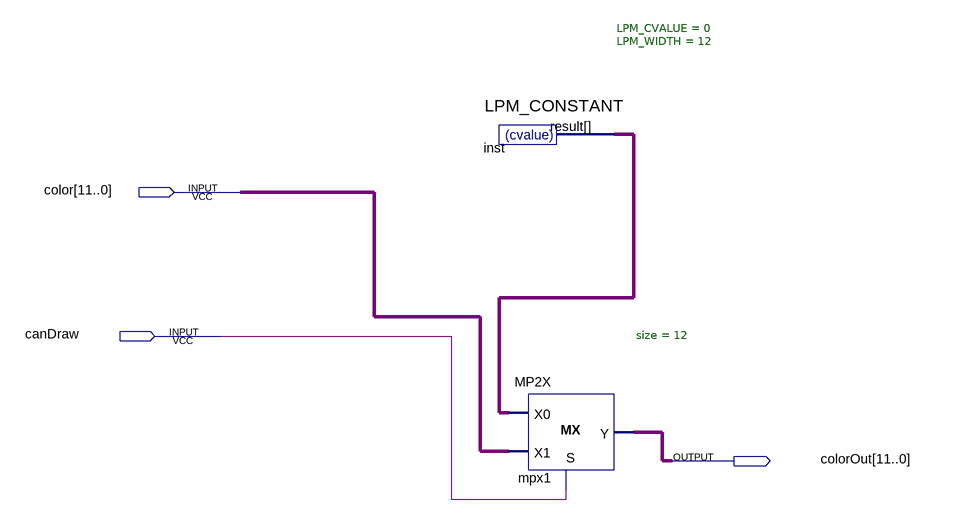
[diagram p0: schematic sheet]
// Quartus schematic color.bdf as structural Verilog: 2 symbols, 3 pins
module color (
  input  [11:0] color,
  input  canDraw,
  output [11:0] colorOut
);

  wire [11:0] inst_result;

  LPM_CONSTANT #(.LPM_CVALUE(0), .LPM_WIDTH(12)) inst (.result(inst_result));
  MP2X #(.size(12)) mpx1 (.S(canDraw), .X0(inst_result), .X1(color), .Y(colorOut));
endmodule
